# EAGLE schematic Joulev1 (EAGLE 7.6.0)
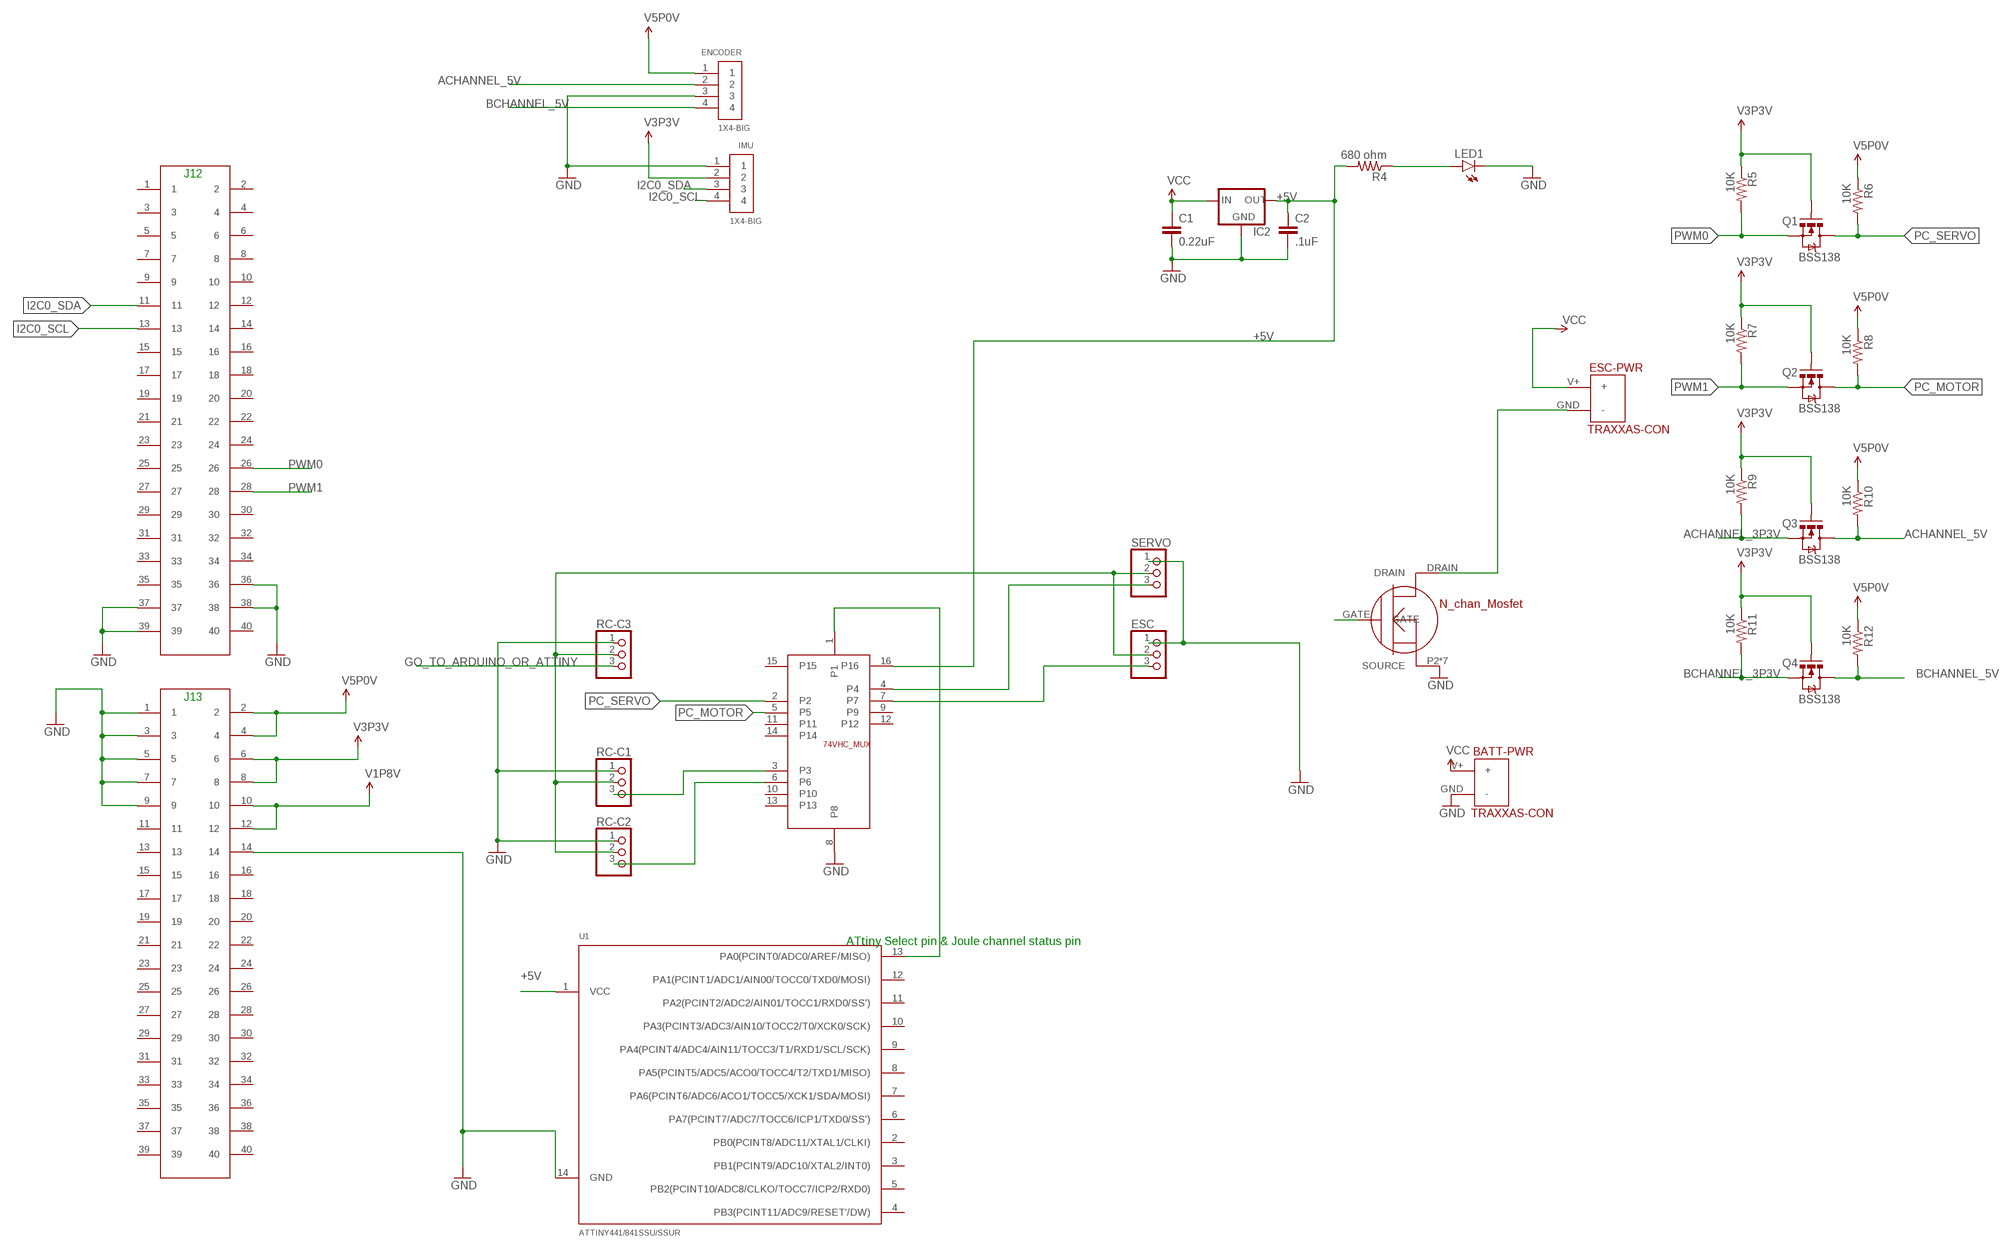
[diagram p0: schematic, sheet 1]

## Parts
BATT-PWR  TRAXXAS-CON  [TRAXXAS-CON]
C1  0.22uF  0.22UF-25V-10%(0603)  [0603-CAP]
C2  .1uF  0.22UF-25V-10%(0603)  [0603-CAP]
ENCODER  1X4-BIG  [1X04-BIG]
ESC  PINHD-1X3  [1X03]
ESC-PWR  TRAXXAS-CON  [TRAXXAS-CON]
IC2  V_REG_78XX-TO-220  [TO-220-ALT]
IMU  1X4-BIG  [1X04-BIG]
J12_HEADER  J12HEADER_(JOULE)  [2X20]
LED1  LED0603  [LED-0603]
Q1  BSS138  MOSFET-NCHANNELSMD  [SOT23-3]
Q2  BSS138  MOSFET-NCHANNELSMD  [SOT23-3]
Q3  BSS138  MOSFET-NCHANNELSMD  [SOT23-3]
Q4  BSS138  MOSFET-NCHANNELSMD  [SOT23-3]
R4  680 ohm  R-US_R0603  [R0603]
R5  10K  RESISTOR0603-RES  [0603-RES]
R6  10K  RESISTOR0603-RES  [0603-RES]
R7  10K  RESISTOR0603-RES  [0603-RES]
R8  10K  RESISTOR0603-RES  [0603-RES]
R9  10K  RESISTOR0603-RES  [0603-RES]
R10  10K  RESISTOR0603-RES  [0603-RES]
R11  10K  RESISTOR0603-RES  [0603-RES]
R12  10K  RESISTOR0603-RES  [0603-RES]
RC-C1  PINHD-1X3  [1X03]
RC-C2  PINHD-1X3  [1X03]
RC-C3  PINHD-1X3  [1X03]
SERVO  PINHD-1X3  [1X03]
U1  ATTINY441/841SSU/SSUR  [SOIC-14]
U$1  J13HEADER_(JOULE)  [2X20]
U$2  74VHC_MUXSO16  [SO16]
U$3  N_CH_MOSFET_FDLBL260N100  [MO-299A]

## Nets
+5V: C2.1 IC2.OUT R4.2 U1.1(VCC) U$2.16
ACHANNEL_3P3V: Q3.2(S) R9.2
ACHANNEL_5V: ENCODER.2 Q3.3(D) R10.2
BCHANNEL_3P3V: Q4.2(S) R11.2
BCHANNEL_5V: ENCODER.4 Q4.3(D) R12.2
GND: BATT-PWR.GND(-) C1.2 C2.2 ENCODER.3 ESC.1 IC2.GND IMU.1 J12_HEADER.36 J12_HEADER.37 J12_HEADER.38 J12_HEADER.39 LED1.C RC-C1.1 RC-C2.1 RC-C3.1 SERVO.1 U1.14(GND) U$1.1 U$1.3 U$1.5 U$1.7 U$1.9 U$1.14 U$2.8 U$3.P2(SOURCE) U$3.P3(SOURCE) U$3.P4(SOURCE) U$3.P5(SOURCE) U$3.P6(SOURCE) U$3.P7(SOURCE) U$3.P8(SOURCE)
GO_TO_ARDUINO_OR_ATTINY: RC-C3.3
I2C0_SCL: IMU.4 J12_HEADER.13
I2C0_SDA: IMU.3 J12_HEADER.11
N$2: SERVO.3 U$2.4
N$3: ESC.3 U$2.7
N$4: U$3.GATE
N$5: ESC-PWR.GND(-) U$3.DRAIN
N$7: ESC.2 RC-C1.2 RC-C2.2 RC-C3.2 SERVO.2
N$10: RC-C1.3 U$2.3
N$11: RC-C2.3 U$2.6
N$20: LED1.A R4.1
N$24: U1.13(PA0(PCINT0/ADC0/AREF/MISO)) U$2.1
PC_MOTOR: Q2.3(D) R8.2 U$2.5
PC_SERVO: Q1.3(D) R6.2 U$2.2
PWM0: J12_HEADER.26 Q1.2(S) R5.2
PWM1: J12_HEADER.28 Q2.2(S) R7.2
V1P8V: U$1.10 U$1.12
V3P3V: IMU.2 Q1.1(G) Q2.1(G) Q3.1(G) Q4.1(G) R5.1 R7.1 R9.1 R11.1 U$1.6 U$1.8
V5P0V: R6.1 R8.1 R10.1 R12.1 U$1.2 U$1.4
VCC: BATT-PWR.V+(+) C1.1 ENCODER.1 ESC-PWR.V+(+) IC2.IN ; supply symbol labelled V5P0V
Unconnected: J12_HEADER.1 J12_HEADER.2 J12_HEADER.3 J12_HEADER.4 J12_HEADER.5 J12_HEADER.6 J12_HEADER.7 J12_HEADER.8 J12_HEADER.9 J12_HEADER.10 J12_HEADER.12 J12_HEADER.14 J12_HEADER.15 J12_HEADER.16 J12_HEADER.17 J12_HEADER.18 J12_HEADER.19 J12_HEADER.20 J12_HEADER.21 J12_HEADER.22 J12_HEADER.23 J12_HEADER.24 J12_HEADER.25 J12_HEADER.27 J12_HEADER.29 J12_HEADER.30 J12_HEADER.31 J12_HEADER.32 J12_HEADER.33 J12_HEADER.34 J12_HEADER.35 J12_HEADER.40 U1.2(PB0(PCINT8/ADC11/XTAL1/CLKI)) U1.3(PB1(PCINT9/ADC10/XTAL2/INT0)) U1.4(PB3(PCINT11/ADC9/RESET'/DW)) U1.5(PB2(PCINT10/ADC8/CLKO/TOCC7/ICP2/RXD0)) U1.6(PA7(PCINT7/ADC7/TOCC6/ICP1/TXD0/SS')) U1.7(PA6(PCINT6/ADC6/ACO1/TOCC5/XCK1/SDA/MOSI)) U1.8(PA5(PCINT5/ADC5/ACO0/TOCC4/T2/TXD1/MISO)) U1.9(PA4(PCINT4/ADC4/AIN11/TOCC3/T1/RXD1/SCL/SCK)) U1.10(PA3(PCINT3/ADC3/AIN10/TOCC2/T0/XCK0/SCK)) U1.11(PA2(PCINT2/ADC2/AIN01/TOCC1/RXD0/SS')) U1.12(PA1(PCINT1/ADC1/AIN00/TOCC0/TXD0/MOSI)) U$1.11 U$1.13 U$1.15 U$1.16 U$1.17 U$1.18 U$1.19 U$1.20 U$1.21 U$1.22 U$1.23 U$1.24 U$1.25 U$1.26 U$1.27 U$1.28 U$1.29 U$1.30 U$1.31 U$1.32 U$1.33 U$1.34 U$1.35 U$1.36 U$1.37 U$1.38 U$1.39 U$1.40 U$2.9 U$2.10 U$2.11 U$2.12 U$2.13 U$2.14 U$2.15

## Notes on the sheet
- J12
- J13
- ATtiny Select pin & Joule channel status pin

## Library data of the parts
BATT-PWR ESC-PWR = Roboracing:TRAXXAS-CON
C1 = SparkFun-Capacitors:0.22UF-25V-10%(0603): CAP-07822; PROD_ID: CAP-07822
C2 = SparkFun-Capacitors:0.22UF-25V-10%(0603): CAP-07822; PROD_ID: CAP-07822; VALUE: 0.22uF
ENCODER IMU = adafruit:1X4: 4-pin connector
ESC RC-C1-RC-C3 SERVO = adafruit:PINHD-1X3: PIN HEADER
IC2 = SparkFun-PowerIC:V_REG_78XX: Voltage Regulator Standard 7805 5V regulator. IGO (Input Ground Output). Spark Fun Electronics SKU : COM-00107
J12_HEADER = Roboracing:J12HEADER_(JOULE)
LED1 = SparkFun-LED:LED: LEDs Standard schematic elements and footprints for 5mm, 3mm, 1206, and 0603 sized LEDs. 5mm - Spark Fun Electronics SKU : COM-00529 (and others)
Q1-Q4 = SparkFun:MOSFET-NCHANNEL
R4 = rcl:R-US_: RESISTOR, American symbol
R5-R12 = SparkFun:RESISTOR: Resistor Basic schematic elements and footprints for 0603, 1206, and PTH resistors.
U1 = rgb-led:ATTINY441/841
U$1 = Roboracing:J13HEADER_(JOULE)
U$2 = Roboracing:74VHC_MUX
U$3 = Roboracing:N_CH_MOSFET_FDLBL260N100